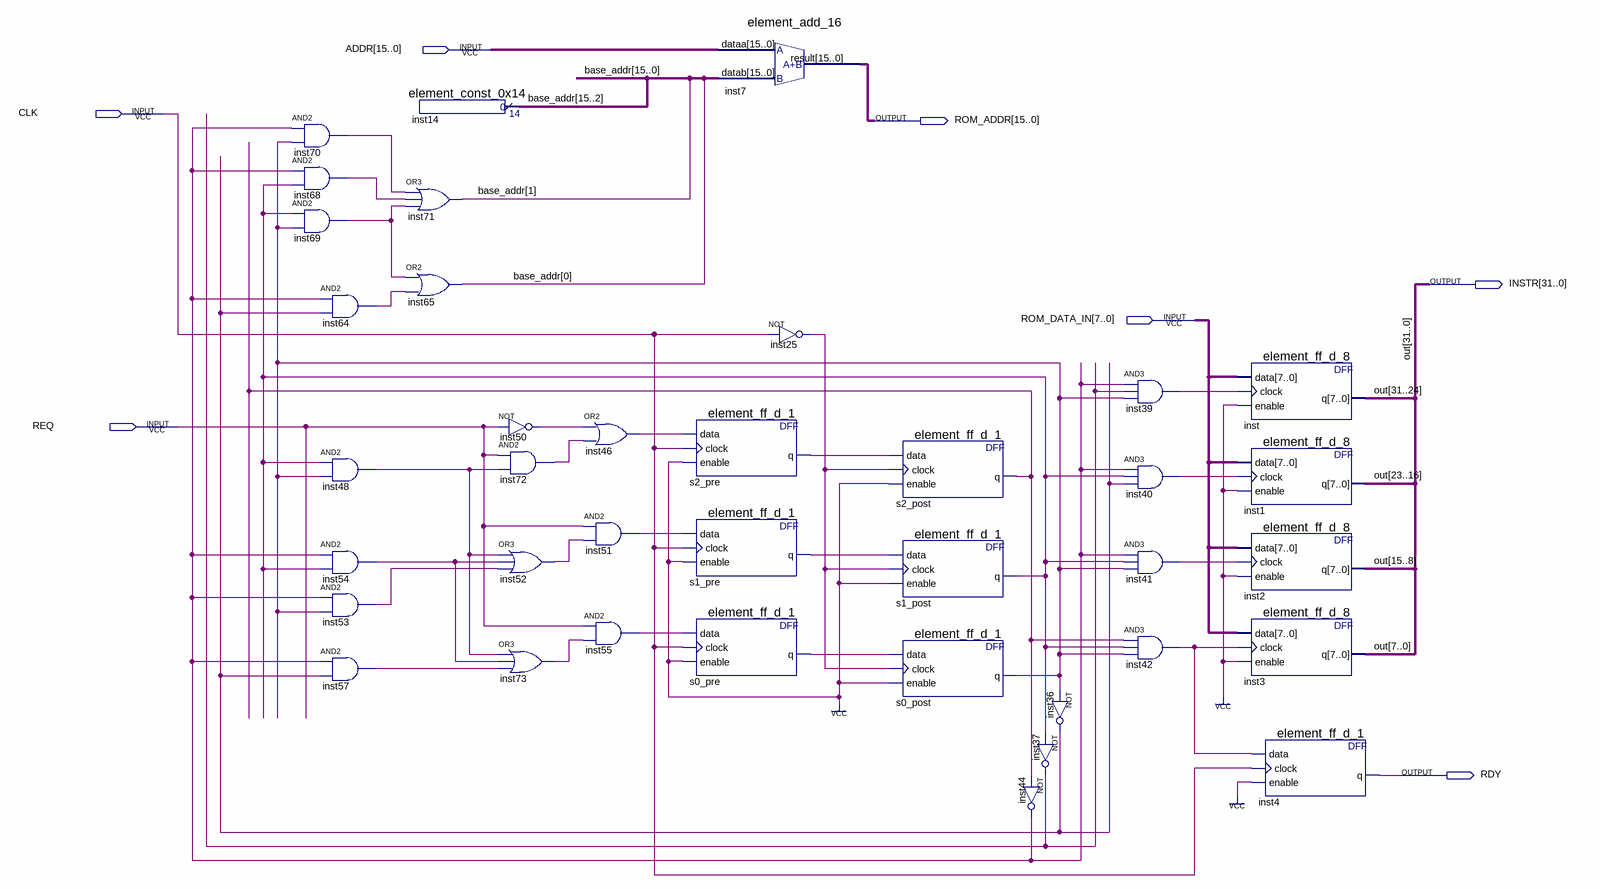
[diagram p0: schematic sheet]
// Quartus schematic block-stage-instruction-fetch.bdf as structural Verilog: 38 symbols, 7 pins
module \block-stage-instruction-fetch  (
  input  [15:0] ADDR,
  input  CLK,
  input  [7:0] ROM_DATA_IN,
  input  REQ,
  output [15:0] ROM_ADDR,
  output [31:0] INSTR,
  output RDY
);

  wire inst25_out, inst36_out, inst37_out, inst39_out, inst40_out, inst41_out, inst42_out, inst44_out,
       inst46_out, inst48_out, inst50_out, inst51_out, inst52_out, inst53_out, inst54_out, inst55_out,
       inst57_out, inst64_out, inst68_out, inst69_out, inst70_out, inst72_out, inst73_out, s0_post_q,
       s0_pre_q, s1_post_q, s1_pre_q, s2_post_q, s2_pre_q;
  wire [15:0] base_addr;

  and inst70 (inst70_out, inst44_out, s0_post_q);
  and inst68 (inst68_out, inst44_out, s1_post_q);
  and inst69 (inst69_out, s1_post_q, s0_post_q);
  and inst64 (inst64_out, inst44_out, inst36_out);
  and inst48 (inst48_out, s1_post_q, s0_post_q);
  and inst54 (inst54_out, inst44_out, s1_post_q);
  and inst53 (inst53_out, inst44_out, s0_post_q);
  and inst57 (inst57_out, inst44_out, inst36_out);
  element_const_0x14 inst14 (.result(base_addr[15:2]));
  or inst71 (base_addr[1], inst70_out, inst68_out, inst69_out);
  or inst65 (base_addr[0], inst69_out, inst64_out);
  not inst50 (inst50_out, REQ);
  and inst72 (inst72_out, REQ, inst48_out);
  or inst52 (inst52_out, inst48_out, inst54_out, inst53_out);
  or inst73 (inst73_out, inst48_out, inst54_out, inst57_out);
  or inst46 (inst46_out, inst50_out, inst72_out);
  and inst51 (inst51_out, REQ, inst52_out);
  and inst55 (inst55_out, REQ, inst73_out);
  element_ff_d_1 s2_pre (.data(inst46_out), .clock(CLK), .enable(1'b1), .q(s2_pre_q));
  element_ff_d_1 s1_pre (.data(inst51_out), .clock(CLK), .enable(1'b1), .q(s1_pre_q));
  element_ff_d_1 s0_pre (.data(inst55_out), .clock(CLK), .enable(1'b1), .q(s0_pre_q));
  element_add_16 inst7 (.dataa(ADDR), .datab(base_addr), .result(ROM_ADDR));
  not inst25 (inst25_out, CLK);
  element_ff_d_1 s2_post (.data(s2_pre_q), .clock(inst25_out), .enable(1'b1), .q(s2_post_q));
  element_ff_d_1 s1_post (.data(s1_pre_q), .clock(inst25_out), .enable(1'b1), .q(s1_post_q));
  element_ff_d_1 s0_post (.data(s0_pre_q), .clock(inst25_out), .enable(1'b1), .q(s0_post_q));
  not inst37 (inst37_out, s1_post_q);
  not inst44 (inst44_out, s2_post_q);
  not inst36 (inst36_out, s0_post_q);
  and inst39 (inst39_out, inst44_out, inst37_out, s0_post_q);
  and inst40 (inst40_out, inst44_out, s1_post_q, inst36_out);
  and inst41 (inst41_out, inst44_out, s1_post_q, s0_post_q);
  and inst42 (inst42_out, s2_post_q, s1_post_q, s0_post_q);
  element_ff_d_8 inst (.data(ROM_DATA_IN), .clock(inst39_out), .enable(1'b1), .q(INSTR[31:24]));
  element_ff_d_8 inst1 (.data(ROM_DATA_IN), .clock(inst40_out), .enable(1'b1), .q(INSTR[23:16]));
  element_ff_d_8 inst2 (.data(ROM_DATA_IN), .clock(inst41_out), .enable(1'b1), .q(INSTR[15:8]));
  element_ff_d_8 inst3 (.data(ROM_DATA_IN), .clock(inst42_out), .enable(1'b1), .q(INSTR[7:0]));
  element_ff_d_1 inst4 (.data(inst42_out), .clock(CLK), .enable(1'b1), .q(RDY));

  // Other names for the same wires on the sheet: out[31:0] = INSTR
endmodule
